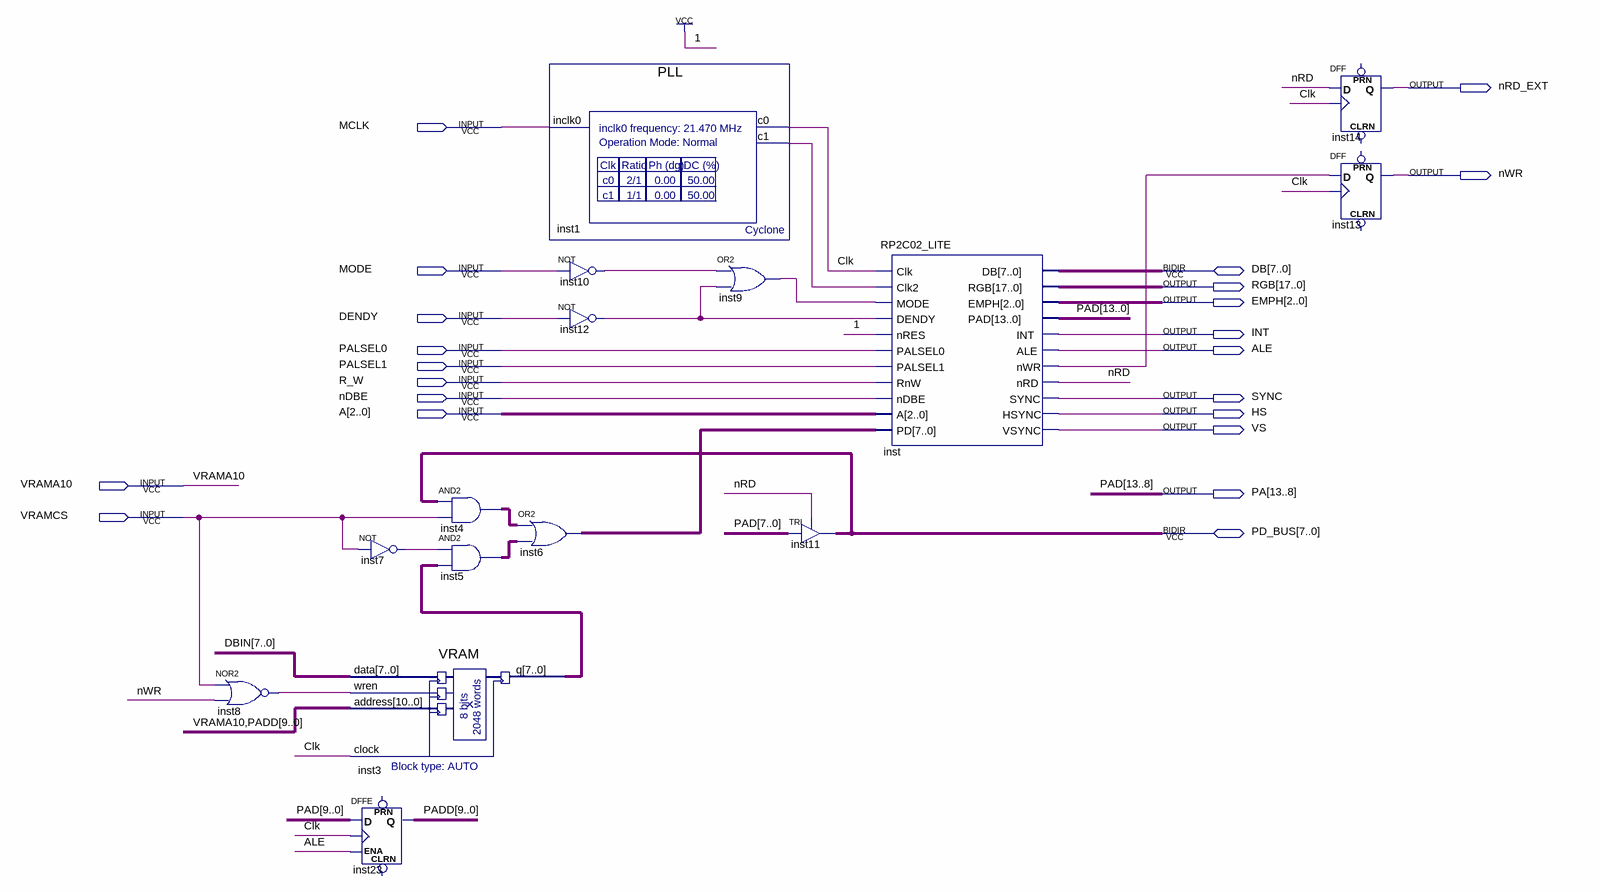
[diagram p0: schematic sheet]
// Quartus schematic PPU_LITE_VRAM.bdf as structural Verilog: 15 symbols, 22 pins
module PPU_LITE_VRAM (
  input  MCLK,
  input  MODE,
  input  DENDY,
  input  PALSEL0,
  input  PALSEL1,
  input  R_W,
  input  nDBE,
  input  [2:0] A,
  input  VRAMA10,
  input  VRAMCS,
  inout  [7:0] DB,
  inout  [7:0] PD_BUS,
  output nRD_EXT,
  output nWR,
  output [17:0] RGB,
  output [2:0] EMPH,
  output INT,
  output ALE,
  output SYNC,
  output HS,
  output VS,
  output [13:8] PA
);

  wire Clk, inst1_c1, inst7_out, inst8_out, inst9_out, inst10_out, inst12_out, inst_nwr, nRD;
  wire [7:0] DBIN, inst3_q, inst4_out, inst5_out, inst6_out, PAD;
  wire [9:0] PADD;

  nor inst8 (inst8_out, VRAMCS, nWR);
  VRAM inst3 (.data(DBIN), .wren(inst8_out), .address({VRAMA10, PADD}), .clock(Clk), .q(inst3_q));
  DFFE inst23[9:0] (.D({PA[9:8], PAD}), .CLK(Clk), .ENA(ALE), .Q(PADD));  // open: PRN, CLRN
  not inst7 (inst7_out, VRAMCS);
  assign inst4_out = PD_BUS & {8{VRAMCS}};  // AND2 inst4, 8 bits wide
  assign inst5_out = {8{inst7_out}} & inst3_q;  // AND2 inst5, 8 bits wide
  assign inst6_out = inst4_out | inst5_out;  // OR2 inst6, 8 bits wide
  PLL inst1 (.inclk0(MCLK), .c0(Clk), .c1(inst1_c1));
  not inst10 (inst10_out, MODE);
  not inst12 (inst12_out, DENDY);
  or inst9 (inst9_out, inst10_out, inst12_out);
  TRI inst11[7:0] (.IN(PAD), .OE(nRD), .OUT(PD_BUS));
  RP2C02_LITE inst (
    .Clk(Clk), .Clk2(inst1_c1), .MODE(inst9_out), .DENDY(inst12_out), .nRES(1'b1), .PALSEL0(PALSEL0),
    .PALSEL1(PALSEL1), .RnW(R_W), .nDBE(nDBE), .A(A), .PD(inst6_out), .RGB(RGB), .EMPH(EMPH),
    .PAD({PA, PAD}), .INT(INT), .ALE(ALE), .nWR(inst_nwr), .nRD(nRD), .SYNC(SYNC), .HSYNC(HS), .VSYNC(VS),
    .DB(DB));
  DFF inst14 (.CLK(Clk), .D(nRD), .Q(nRD_EXT));  // open: CLRN, PRN
  DFF inst13 (.CLK(Clk), .D(inst_nwr), .Q(nWR));  // open: CLRN, PRN

  // Other names for the same wires on the sheet: PAD[13:8] = PA
endmodule
